# EAGLE design Dual_linear_VCA_chip_v3.0_-_external_trimmers (EAGLE 7.7.0)
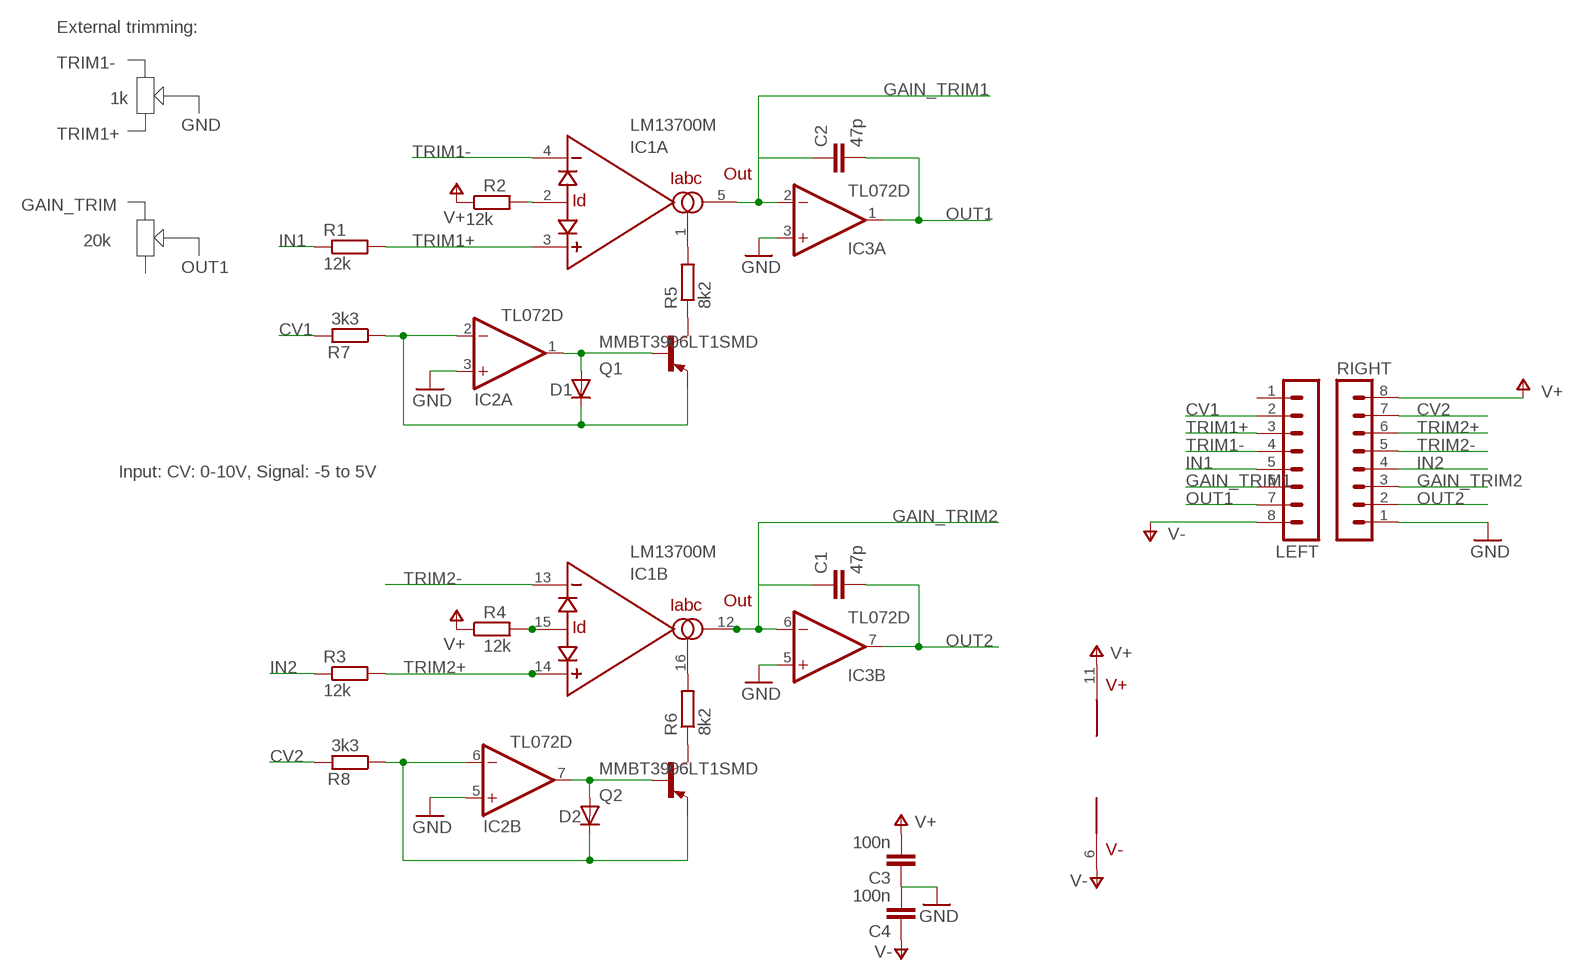
[diagram p0: schematic, sheet 1]

## Parts
C1  47p  C-EUC0805  [C0805]
C2  47p  C-EUC0805  [C0805]
C3  100n  C-EUC0805  [C0805]
C4  100n  C-EUC0805  [C0805]
D1  DIODE-SOD80C  [SOD80C]
D2  DIODE-SOD80C  [SOD80C]
IC1  LM13700M  [SO16]
IC2  TL072D  [SO08]
IC3  TL072D  [SO08]
LEFT  MA08-1JC  [MA08-1J]
Q1  MMBT3906LT1SMD  [SOT23-BEC]
Q2  MMBT3906LT1SMD  [SOT23-BEC]
R1  12k  R-EU_R0805  [R0805]
R2  12k  R-EU_R0805  [R0805]
R3  12k  R-EU_R0805  [R0805]
R4  12k  R-EU_R0805  [R0805]
R5  8k2  R-EU_R0805  [R0805]
R6  8k2  R-EU_R0805  [R0805]
R7  3k3  R-EU_R0805  [R0805]
R8  3k3  R-EU_R0805  [R0805]
RIGHT  MA08-1JC  [MA08-1J]

## Nets
CV1: LEFT.2 R7.2
CV2: R8.2 RIGHT.7
GAIN_TRIM1: C2.1 IC1.5(A:OUT) IC3.2(A:-IN) LEFT.6
GAIN_TRIM2: C1.1 IC1.12(B:OUT) IC3.6(B:-IN) RIGHT.3
GND: C3.1 C4.2 IC2.3(A:+IN) IC2.5(B:+IN) IC3.3(A:+IN) IC3.5(B:+IN) RIGHT.1
IN1: LEFT.5 R1.1
IN2: R3.1 RIGHT.4
N$1: Q1.C R5.1
N$2: Q2.C R6.1
N$3: D1.C IC2.2(A:-IN) Q1.E R7.1
N$4: IC1.1(A:IABC) R5.2
N$6: IC1.2(A:ID) R2.2
N$8: D2.A IC2.7(B:OUT) Q2.B
N$10: D1.A IC2.1(A:OUT) Q1.B
N$11: D2.C IC2.6(B:-IN) Q2.E R8.1
N$14: IC1.16(B:IABC) R6.2
N$17: IC1.15(B:ID) R4.2
OUT1: C2.2 IC3.1(A:OUT) LEFT.7
OUT2: C1.2 IC3.7(B:OUT) RIGHT.2
TRIM1+: IC1.3(A:+IN) LEFT.3 R1.2
TRIM1-: IC1.4(A:-IN) LEFT.4
TRIM2+: IC1.14(B:+IN) R3.2 RIGHT.6
TRIM2-: IC1.13(B:-IN) RIGHT.5
V+: C3.2 IC1.11(V+) R2.1 R4.1 RIGHT.8
V-: C4.1 IC1.6(V-) LEFT.8
Unconnected: IC1.7(IN) IC1.8(OUT) IC1.9(OUT) IC1.10(IN) LEFT.1

## Notes on the sheet
- External trimming:
- TRIM1-
- 1k
- GND
- TRIM1+
- GAIN_TRIM
- 20k
- OUT1
- Input: CV: 0-10V, Signal: -5 to 5V

## Power pins joined to a net without a drawn wire
V+: IC2.8(P:V+) IC3.8(P:V+)
V-: IC2.4(P:V-) IC3.4(P:V-)

## Library data of the parts
C1-C4 = resistor:C-EU: CAPACITOR, European symbol
D1 D2 = diode:DIODE-: DIODE
IC1 = synthdiy:LM13700: National Dual OTA with buffers.
IC2 IC3 = linear:TL072: OP AMP
LEFT RIGHT = joakim:MA08-1J: PIN HEADER; OC_FARNELL: unknown; OC_NEWARK: unknown
Q1 Q2 = transistor-pnp:MMBT3906*: PNP Transistror
R1-R8 = resistor:R-EU_: RESISTOR, European symbol

## Board
v1.1: Fixed mixed up output pins
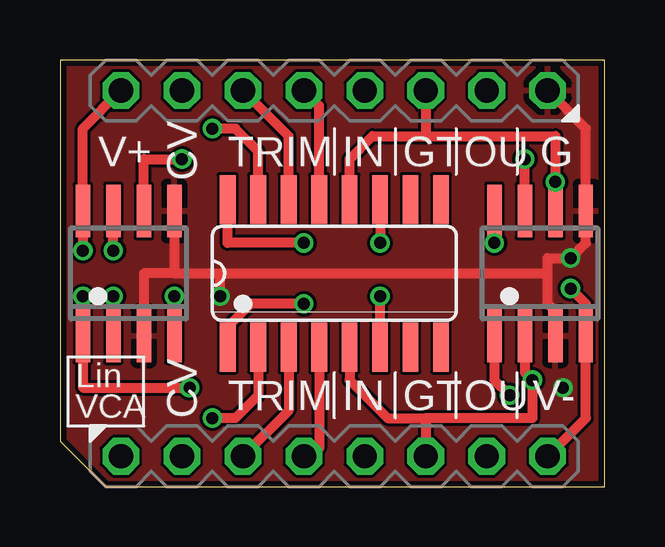
[diagram p1: board, top side]
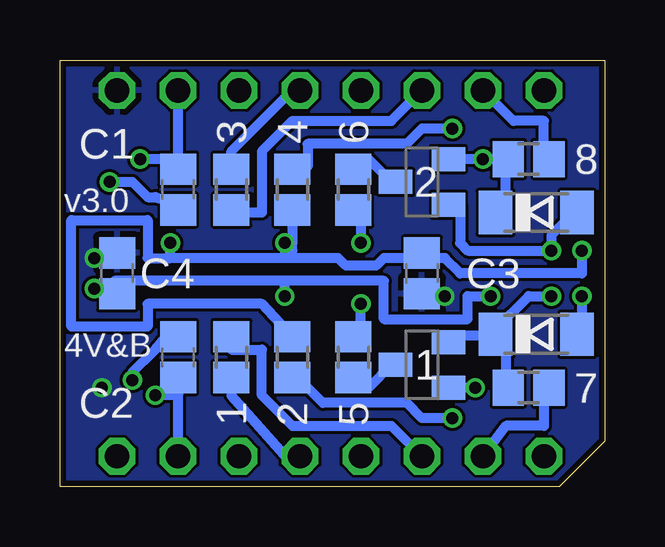
[diagram p2: board, bottom side, seen from below]

Size 22.7 x 17.78 mm. Coordinates in mm from the lower left corner, seen from the top.
Outline: 1.91,0 22.7,0 22.7,17.78 0,17.78 0,1.91 1.91,0
Copper layers (1*16): Top 0.035mm / dielectric 1.5mm / Bottom 0.035mm
Design rules "dirt_cheap_dirty_boards.v1": minimum track width 5mil, minimum drill 12mil, track to track 5mil, track to pad 5mil, pad to pad 5mil, via to via 5mil, smd to smd 0mil, copper to edge 10mil, drill to drill 10mil, minimum pad ring 10mil, minimum via ring 6mil, stop-mask expansion 2mil, vias tented up to drill 25mil, thermal gap 10mil

### Footprints (pad centres in the part's own frame; a part is rotated, then mirrored left to right if it is on the bottom)
C0805 = smd 1.3 x 1.5: 1 -0.85,0; 2 0.85,0
SOD80C = smd 1.4 x 1.8: A 1.7,0; C -1.7,0
SO16 = smd 0.66 x 2.032: 1 -4.445,-3.073; 2 -3.175,-3.073; 3 -1.905,-3.073; 4 -0.635,-3.073; 5 0.635,-3.073; 6 1.905,-3.073; 7 3.175,-3.073; 8 4.445,-3.073; 9 4.445,3.073; 10 3.175,3.073; 11 1.905,3.073; 12 0.635,3.073; 13 -0.635,3.073; 14 -1.905,3.073; 15 -3.175,3.073; 16 -4.445,3.073
SO08 = smd 0.6 x 2.2: 1 -1.905,-2.6; 2 -0.635,-2.6; 3 0.635,-2.6; 4 1.905,-2.6; 5 1.905,2.6; 6 0.635,2.6; 7 -0.635,2.6; 8 -1.905,2.6
MA08-1J = drill 1.016 octagon: 1 -8.89,0; 2 -6.35,0; 3 -3.81,0; 4 -1.27,0; 5 1.27,0; 6 3.81,0; 7 6.35,0; 8 8.89,0
SOT23-BEC = smd 1 x 1.4: B -0.95,-1.1; C 0,1.1; E 0.95,-1.1
R0805 = smd 1.3 x 1.5: 1 -0.85,0; 2 0.85,0

### Placement (x,y rotation side)
C1  17.78,12.38 90 bottom
C2  17.78,5.4 270 bottom
C3  7.62,8.89 90 bottom
C4  20.32,8.89 90 bottom
D1  2.86,6.35 0 bottom
D2  2.86,11.43 0 bottom
IC1  11.43,8.89 0 top
IC2  2.86,8.89 0 top
IC3  20,8.89 0 top
LEFT  11.43,1.27 0 top
Q1  7.62,5.08 90 bottom
Q2  7.62,12.7 90 bottom
R1  15.56,5.4 90 bottom
R2  13.02,5.4 270 bottom
R3  15.56,12.38 270 bottom
R4  13.02,12.38 90 bottom
R5  10.48,5.4 90 bottom
R6  10.48,12.38 270 bottom
R7  3.17,4.13 0 bottom
R8  3.17,13.65 0 bottom
RIGHT  11.43,16.51 180 top

### Tracks (layer width: path | path; a pad name or v marks a point on that pad's centre or on a via)
CV1
  Bottom 0.406: R7.2 2.22,3.81 2.54,4.13 2.54,2.54 4.13,2.54 LEFT.2
CV2
  Bottom 0.406: R8.2 2.54,13.65 2.54,15.24 3.81,15.24 RIGHT.7
GAIN_TRIM1  (via drill 0.5)
  Top 0.406: IC3.2 19.37,4.76 v19.68,4.45 19.68,2.86 15.24,2.86 | IC1.5 12.06,4.45 13.65,2.86 15.24,2.86 | 15.24,2.86 LEFT.6
  Bottom 0.406: C2.1 18.2,6.35 18.73,5.71 19.68,4.76 v19.68,4.45
GAIN_TRIM2  (via drill 0.5)
  Top 0.406: IC1.12 12.06,13.65 13.02,14.61 15.24,14.61 | IC3.6 v20.64,12.7 20.64,14.61 15.24,14.61 | RIGHT.3 15.24,14.61
  Bottom 0.406: v20.64,12.7 19.68,12.7 19.05,12.06 18.73,12.06 17.57,11.75 C1.1
GND  (via drill 0.5)
  Top 0.406: IC3.3 20.64,7.3 20.32,7.62 20.32,8.89 | 20.32,8.89 20.32,9.53 v21.27,9.53 21.91,10.16 IC3.5 21.91,14.92 RIGHT.1 | 4.76,11.43 IC2.5 4.82,11.43 4.76,11.43 | 4.76,8.89 3.49,8.89 IC2.3 | 4.76,11.43 4.76,8.89 | 4.76,8.89 6.67,8.89 | 6.67,8.89 20.32,8.89 | v6.67,7.94 6.67,8.89
  Bottom 0.406: C3.1 6.77,8.04 v6.67,7.94 | C4.2 20.64,9.53 v21.27,9.53
  other vias: 20.95,4.13
  pour Bottom: -0.64,18.41 -0.64,0 22.86,0 22.86,18.41
  pour Top: 0,17.78 0,-0.64 23.5,-0.64 23.5,17.78
IN1
  Bottom 0.406: R1.1 15.56,3.81 13.02,0.95 LEFT.5
IN2
  Bottom 0.406: 15.46,13.23 R3.1 15.56,13.97 13.02,16.51 RIGHT.4
N$1
  Bottom 0.406: Q1.C 8.89,5.08 9.84,4.13 10.38,4.13 R5.1
N$2
  Bottom 0.406: Q2.C 8.89,12.7 9.84,13.65 10.38,13.65 R6.1
N$3  (via drill 0.5)
  Top 0.406: v2.22,7.94 IC2.2
  Bottom 0.406: 4.5,6.29 5.94,6.29 Q1.E | 4.13,4.13 R7.1 4.13,4.23 4.13,6.29 4.5,6.29 | v2.22,7.94 3.17,7.94 4.56,6.55 D1.C 4.5,6.29
N$4  (via drill 0.5)
  Top 0.406: v10.16,7.62 7.94,7.62 6.99,6.67 IC1.1
  Bottom 0.406: R5.2 10.26,6.25 10.16,6.35 v10.16,7.62
N$6  (via drill 0.5)
  Top 0.406: IC1.2 8.26,3.81 7.3,2.86 v6.35,2.86
  Bottom 0.406: v6.35,2.86 7.62,2.86 8.26,3.49 11.75,3.49 12.48,4.23 R2.2
N$8  (via drill 0.5)
  Top 0.406: v2.22,9.84 IC2.7
  Bottom 0.406: Q2.B 6.04,11.75 6.03,11.75 6.03,10.16 5.71,9.84 v2.22,9.84 2.22,10.48 1.27,11.43 D2.A
N$10  (via drill 0.5)
  Top 0.406: v0.95,7.94 IC2.1 0.95,4.13 v5.4,4.13
  Bottom 0.406: v5.4,4.13 6.35,4.13 6.5,4.28 6.03,3.96 Q1.B | v0.95,7.94 0.95,6.55 D1.A
N$11  (via drill 0.5)
  Top 0.406: IC2.6 3.49,13.65 v5.08,13.65
  Bottom 0.406: Q2.E 6.2,13.65 v5.08,13.65 R8.1 4.13,13.55 4.13,11.43 D2.C
N$14  (via drill 0.5)
  Top 0.406: v10.16,10.16 6.99,10.16 IC1.16
  Bottom 0.406: R6.2 10.16,11.43 v10.16,10.16
N$17  (via drill 0.5)
  Top 0.406: IC1.15 8.26,13.97 7.3,14.92 v6.35,14.92
  Bottom 0.406: v6.35,14.92 7.62,14.92 8.26,14.29 12.38,14.29 12.38,13.34 R4.2
OUT1  (via drill 0.5)
  Top 0.406: IC3.1 18.1,4.45 v18.73,3.81
  Bottom 0.406: v18.73,3.81 17.78,3.81 C2.2 LEFT.7
OUT2  (via drill 0.5)
  Top 0.406: IC3.7 v19.37,13.65
  Bottom 0.406: C1.2 17.78,13.65 | 17.78,13.65 v19.37,13.65 | 17.78,13.65 RIGHT.2
TRIM1+
  Top 0.406: IC1.3 9.53,3.17 LEFT.3
  Bottom 0.406: R1.2 15.56,5.71 14.29,5.71 14.29,3.81 13.02,2.54 8.89,2.54 LEFT.3
TRIM1-
  Top 0.406: IC1.4 10.79,1.59 LEFT.4
TRIM2+
  Top 0.406: IC1.14 9.53,14.61 RIGHT.6
  Bottom 0.406: R3.2 15.56,11.43 14.29,11.43 14.29,13.97 13.02,15.24 8.89,15.24 RIGHT.6
TRIM2-
  Top 0.406: IC1.13 10.79,15.88 RIGHT.5
V+  (via drill 0.5)
  Top 0.406: IC1.11 v13.34,10.16 | IC3.8 v18.1,10.16 | v0.95,9.84 IC2.8 0.95,14.92 RIGHT.8
  Bottom 0.406: 13.34,9.53 11.11,9.53 10.79,9.21 9.53,9.21 9.21,9.53 7.62,9.53 C3.2 7.72,9.53 6.67,9.53 6.03,8.89 0.95,8.89 v0.95,9.84 | 13.34,9.53 13.02,9.84 13.02,10.16 | 13.02,10.16 v13.34,10.16 13.34,9.53 | 13.34,9.53 18.1,9.53 | 18.1,9.53 19.05,9.53 19.05,11.11 22.23,11.11 22.23,6.67 19.05,6.67 19.05,7.62 14.29,7.62 R2.1 | 18.1,9.53 v18.1,10.16 | R4.1 13.02,10.16
V-  (via drill 0.5)
  Top 0.406: IC1.6 v13.34,7.94 | v21.27,8.26 21.91,7.62 IC3.4 21.91,2.86 LEFT.8 | IC2.4 v4.76,7.94
  Bottom 0.406: 13.34,8.57 9.21,8.57 9.21,6.99 5.71,6.99 5.71,7.94 v4.76,7.94 | v13.34,7.94 13.34,8.57 | 13.34,8.57 20.42,8.57 | 20.42,8.57 C4.1 20.64,8.26 | 20.42,8.57 20.64,8.26 | 20.64,8.26 v21.27,8.26

### Text on the board
tNames: CV | V+ | TRIM | IN | GT | OU | G | Lin | VCA | CV | TRIM | IN | GT | OU | V-
bNames: 6 | 4 | 3 | C1 | 8 | 2 | v3.0 | C3 | C4 | 4V&B | 1 | 7 | 5 | 2 | 1 | C2